# Altium schematic sheet TTAmp_1T3K_amp_tensometer.SchDoc
size A4; ApprovedBy: Krzysztof Belewicz; CheckedBy: Krzysztof Belewicz; Author: Krzysztof Belewicz; CompanyName: Koło Naukowe Systemów Scalonych; DrawnBy: Krzysztof Belewicz; Organization: KNSS; Address1: Koło Naukowe; Address2: Systemów Scalonych; Address3: 00-665 Warszawa; Address4: Nowowiejska 15/19; Revision: 0.1; SheetNumber: 2; SheetTotal: 4
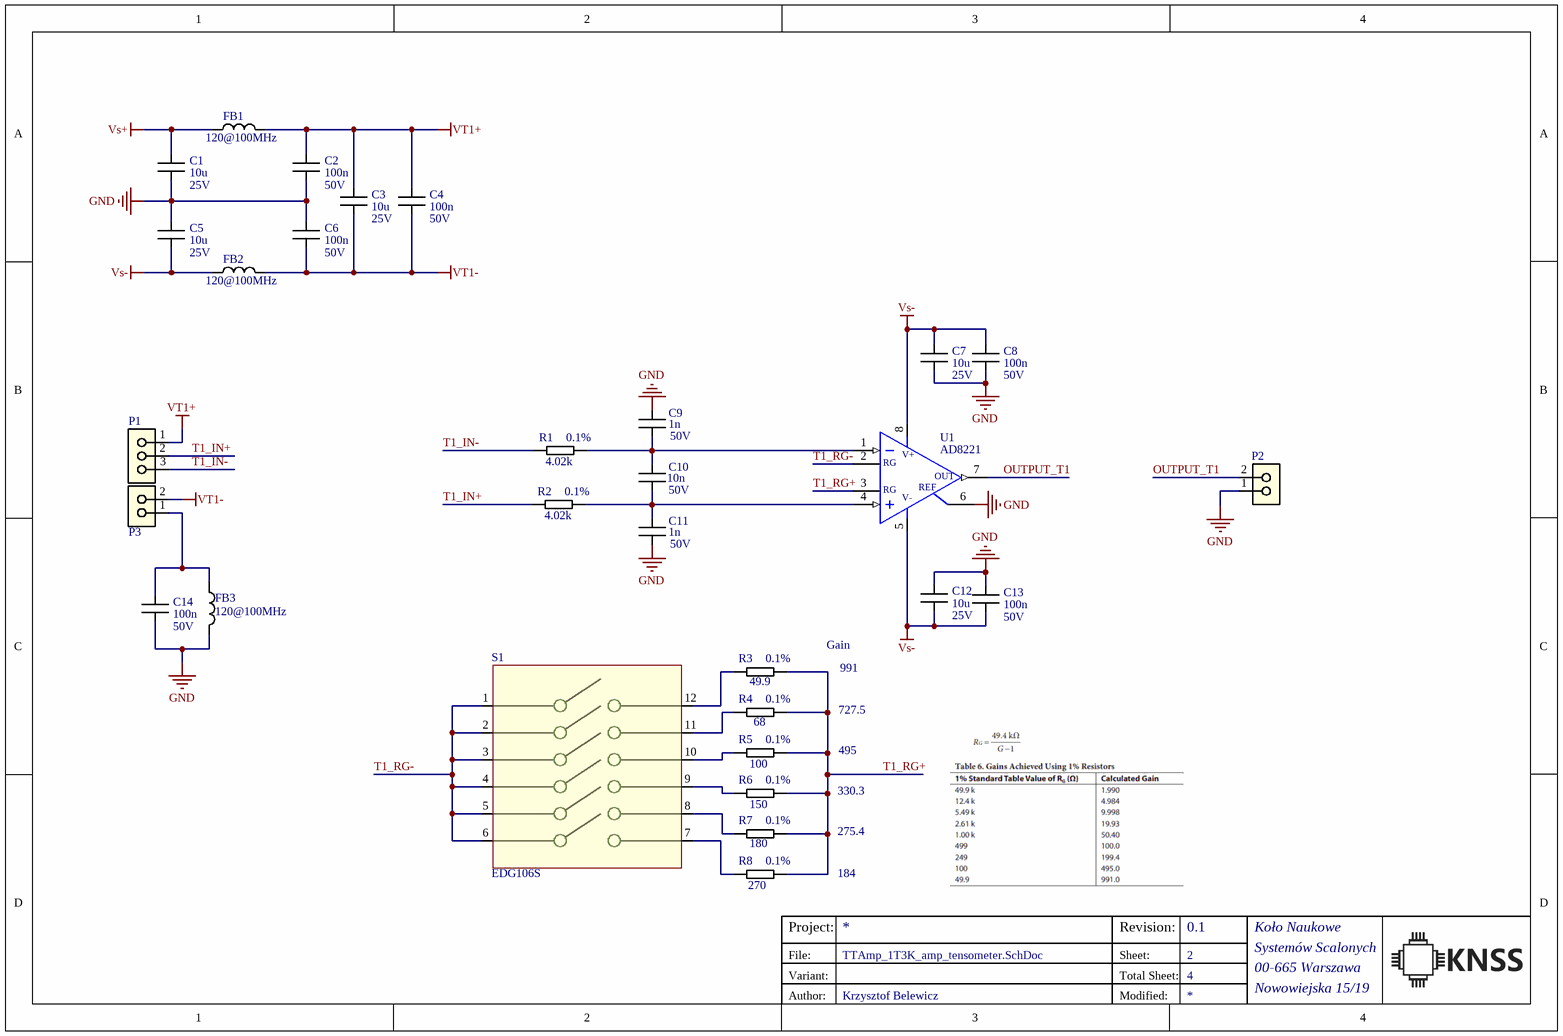
[diagram p0: TTAmp_1T3K_amp_tensometer.SchDoc]

## Parts
C1  value 10u  MaxVoltage: 25V  [CAPC2012N]  (hidden comment: Capacitor)
C2  value 100n  MaxVoltage: 50V  [CAPC1608N]  (hidden comment: Capacitor)
C3  value 10u  MaxVoltage: 25V  [CAPC2012N]  (hidden comment: Capacitor)
C4  value 100n  MaxVoltage: 50V  [CAPC1608N]  (hidden comment: Capacitor)
C5  value 10u  MaxVoltage: 25V  [CAPC2012N]  (hidden comment: Capacitor)
C6  value 100n  MaxVoltage: 50V  [CAPC1608N]  (hidden comment: Capacitor)
C7  value 10u  MaxVoltage: 25V  [CAPC2012N]  (hidden comment: Capacitor)
C8  value 100n  MaxVoltage: 50V  [CAPC1608N]  (hidden comment: Capacitor)
C9  value 1n  MaxVoltage: 50V  [CAPC1608N]  (hidden comment: Capacitor)
C10  value 10n  MaxVoltage: 50V  [CAPC1608N]  (hidden comment: Capacitor)
C11  value 1n  MaxVoltage: 50V  [CAPC1608N]  (hidden comment: Capacitor)
C12  value 10u  MaxVoltage: 25V  [CAPC2012N]  (hidden comment: Capacitor)
C13  value 100n  MaxVoltage: 50V  [CAPC1608N]  (hidden comment: Capacitor)
C14  value 100n  MaxVoltage: 50V  [CAPC1608N]  (hidden comment: Capacitor)
FB1  value 120@100MHz  [INDC1608N]  (hidden comment: Ferrite Bead)
FB2  value 120@100MHz  [INDC1608N]  (hidden comment: Ferrite Bead)
FB3  value 120@100MHz  [INDC1608N]  (hidden comment: Ferrite Bead)
P1  AK100/3DS-5,0-V/GRAU  [AK100/3DS-5,0-V/GRAU]  (value not drawn)
P2  AK100/2DS-5,0-V/GRAU  [AK100/2DS-5,0-V/GRAU]  (value not drawn)
P3  AK100/2DS-5,0-V/GRAU  [AK100/2DS-5,0-V/GRAU]  (value not drawn)
R1  value 4.02k  Tolerance: 0.1%  [RESC1608N]  (hidden comment: Resistor)
R2  value 4.02k  Tolerance: 0.1%  [RESC1608N]  (hidden comment: Resistor)
R3  value 49.9  Tolerance: 0.1%  [RESC1608N]  (hidden comment: Resistor)
R4  value 68  Tolerance: 0.1%  [RESC1608N]  (hidden comment: Resistor)
R5  value 100  Tolerance: 0.1%  [RESC1608N]  (hidden comment: Resistor)
R6  value 150  Tolerance: 0.1%  [RESC1608N]  (hidden comment: Resistor)
R7  value 180  Tolerance: 0.1%  [RESC1608N]  (hidden comment: Resistor)
R8  value 270  Tolerance: 0.1%  [RESC1608N]  (hidden comment: Resistor)
S1  EDG106S
U1  AD8221  [R-8_N]

## Nets
GND: C1.1 C2.1 C5.2 C6.2 C7.1 C8.1 C9.2 C11.1 C12.2 C13.2 C14.1 FB3.2 P2.1 U1.6(REF)
Vs+: C1.2 FB1.2
Vs-: C5.1 C7.2 C8.2 C12.1 C13.1 FB2.2 U1.5(V-) U1.8(V+)
VT1+: C2.2 C3.2 C4.2 FB1.1 P1.1
VT1-: C3.1 C4.1 C6.1 FB2.1 P3.2
OUTPUT_T1: P2.2 U1.7(OUT)
T1_IN+: P1.2 R2.2
T1_IN-: P1.3 R1.2
T1_RG+: R3.1 R4.1 R5.1 R6.1 R7.1 R8.1 U1.3(RG)
T1_RG-: S1.1 S1.2 S1.3 S1.4 S1.5 S1.6 U1.2(RG)
NetC9_1: C9.1 C10.2 R1.1 U1.1(-IN)
NetC10_1: C10.1 C11.2 R2.1 U1.4(+IN)
NetC14_2: C14.2 FB3.1 P3.1
NetR3_2: R3.2 S1.12
NetR4_2: R4.2 S1.11
NetR5_2: R5.2 S1.10
NetR6_2: R6.2 S1.9
NetR7_2: R7.2 S1.8
NetR8_2: R8.2 S1.7

## Notes on the sheet
- Gain
- 727.5
- 991
- 495
- 330.3
- 275.4
- 184
- Project:
- Variant:
- File:
- Sheet:
- Revision:
- Total Sheet:
- Author:
- Modified:

## Library data of the parts
C1-C9 C11-C14 = Capacitor: Tolerance: 10%; Supplier 1: TME; Supplier 2: *
  C1 C3 C5 C7 C12: Supplier Part Number 1: GRM21BR61E106KA73L
  C2 C4 C6 C8 C13 C14: Supplier Part Number 1: CL10B104KB8NNNC
  C9 C11: Supplier Part Number 1: VJ0603Y102KXACW1BC
C10 = Capacitor: Tolerance: 20%; Supplier 1: TME; Supplier 2: *; Supplier Part Number 1: VJ0603Y103MXACW1BC
FB1-FB3 = Inductor: Max Current: 3A; Tolerance: *; Supplier 1: TME; Supplier 2: *; Supplier Part Number 1: BLM18KG121TN1D
P1 = AK100/3DS-5,0-V/GRAU: Listwa zaciskowa do druku; kątowe 90°; 5mm; tory:3; na PCB; 24A; Manufacturer: PTR MESSTECHNIK; Supplier Part Number 1: TB-5.0-P-3P-12; Supplier 1: TME; Manufacturer Part Number: AK100/3DS-5,0-V/GRAU
P2 P3 = AK100/2DS-5,0-V/GRAU: Listwa zaciskowa do druku; kątowe 90°; 5mm; tory:2; na PCB; 24A; Manufacturer: PTR MESSTECHNIK; Supplier Part Number 1: TB-5.0-P-2P-12; Supplier 1: TME; Manufacturer Part Number: AK100/2DS-5,0-V/GRAU
R1 R2 = Resistor: Manufacturer Part Number 1: AR03BTCX4021; Manufacturer 1: VIKING; Power: 0.1W; Supplier 1: TME; Supplier Part Number 1: AR0603-4K02-0.1%
R3 = Resistor: Manufacturer 1: VIKING; Manufacturer Part Number 1: AR03BTCX49R9; Power: 0.1W; Supplier 1: TME; Supplier Part Number 1: AR0603-49R9-0.1%
R4 = Resistor: Manufacturer Part Number 1: AR03BTCX0680; Manufacturer: VIKING; Power: 0.1W; Supplier 1: TME; Supplier Part Number 1: AR0603-68R-0.1%
R5 = Resistor: Manufacturer Part Number 1: AR03BTCX1000; Manufacturer 1: VIKING; Power: 0.1W; Supplier 1: TME; Supplier Part Number 1: AR0603-100R-0.1%
R6 = Resistor: Manufacturer Part Number 1: AR03BTCX1500; Manufacturer 1: VIKING; Power: 0.1W; Supplier 1: TME; Supplier Part Number 1: AR0603-150R-0.1%
R7 = Resistor: Manufacturer Part Number 1: AR03BTCX1800; Manufacturer 1: VIKING; Power: 0.1W; Supplier 1: TME; Supplier Part Number 1: AR0603-180R-0.1%
R8 = Resistor: Manufacturer Part Number 1: AR03BTCX2700; Manufacturer 1: VIKING; Power: 0.1W; Supplier 1: TME; Supplier Part Number 1: AR0603-180R-0.1%
S1 = EDG106S: Przełącznik: DIP-SWITCH; Ilość sekcji:6; ON-OFF; 0,1A/24VDC; 500V; Manufacturer 1: ECE; Manufacturer Part Number 1: EDG106S; Supplier 1: TME; Supplier Part Number 1: EDG106S
U1 = AD8221: Precision Instrumentation Amplifier; Manufacturer Part Number 1: AD8221BRZ; Manufacturer 1: ANALOG DEVICES; PackageReference 1: SOIC_N; ComponentLink1Description: Manufacturer Link; ComponentLink1URL: http://www.analog.com/en/prod/0%2C2877%2CAD622%2C00.html; ComponentLink2Description: Datasheet; ComponentLink2URL: http://www.analog.com/UploadedFiles/Data_Sheets/218546992AD622_c.pdf; Supplier 1: TME; Supplier Part Number 1: AD8221BRZ